# EAGLE design JLink-OB-F072 (EAGLE 7.7.0)
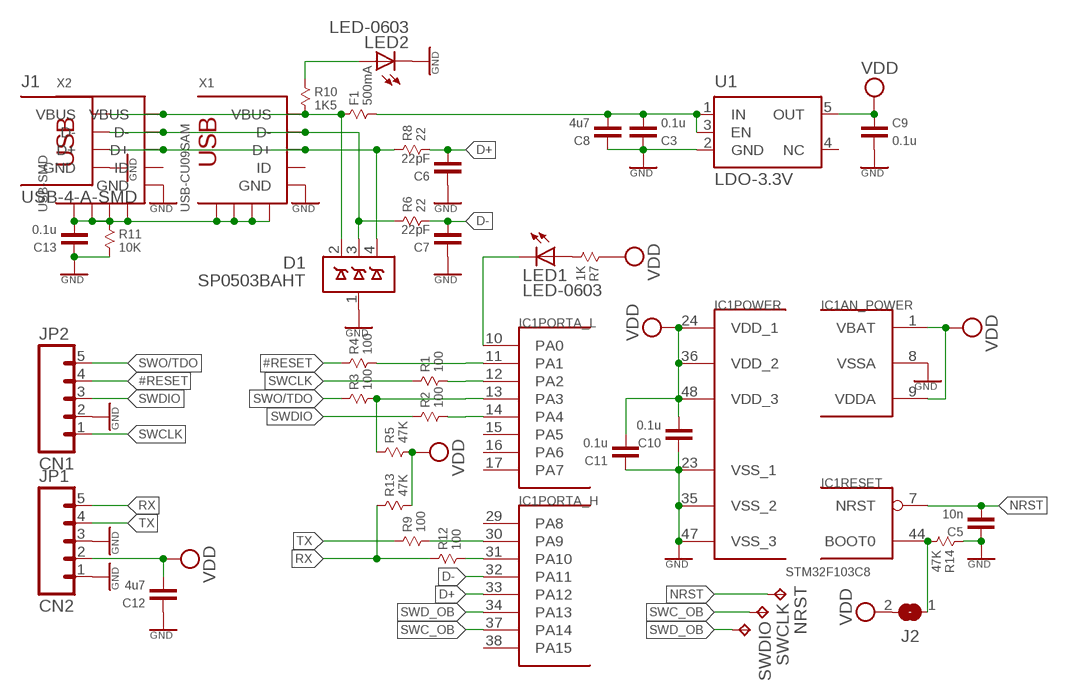
[diagram p0: schematic, sheet 1]

## Parts
C3  0.1u  CAP-0603  [0603]
C5  10n  CAP-0603  [0603]
C6  22pF  CAP-0603  [0603]
C7  22pF  CAP-0603  [0603]
C8  4u7  CAP-0603  [0603]
C9  0.1u  CAP-0603  [0603]
C10  0.1u  CAP-0603  [0603]
C11  0.1u  CAP-0603  [0603]
C12  4u7  CAP-0603  [0603]
C13  0.1u  CAP-0603  [0603]
D1  SP0503BAHT  [SOT143]
F1  500mA  RESISTOR-0805  [0805]
IC1  STM32F103C8  STM32F10XCXT6  [TQFP48]
J1  USB-4-A-SMD  [USB-A-SMD]
J2  JUMPER2-0402-NC  [JUMPER2-0402_NC]
JP1  CN2  M05PTH  [1X05]
JP2  CN1  M05PTH  [1X05]
LED1  LED-0603  LEDCHIPLED_0603  [CHIPLED_0603]
LED2  LED-0603  LEDCHIPLED_0603  [CHIPLED_0603]
NRST  TPTP10R  [TP10R]
R1  100  RESISTOR-0603  [0603]
R2  100  RESISTOR-0603  [0603]
R3  100  RESISTOR-0603  [0603]
R4  100  RESISTOR-0603  [0603]
R5  47K  RESISTOR-0603  [0603]
R6  22  RESISTOR-0603  [0603]
R7  1K  RESISTOR-0603  [0603]
R8  22  RESISTOR-0603  [0603]
R9  100  RESISTOR-0603  [0603]
R10  1K5  RESISTOR-0603  [0603]
R11  10K  RESISTOR-0603  [0603]
R12  100  RESISTOR-0603  [0603]
R13  47K  RESISTOR-0603  [0603]
R14  47K  RESISTOR-0603  [0603]
SWCLK  TPTP10R  [TP10R]
SWDIO  TPTP10R  [TP10R]
U1  LDO-3.3V  TPS73033-DC  [SOT23-5]
X1  USB-CU09SAM  [CU09SAM]
X2  USB-SMD  [USB-MINIB]

## Nets
#RESET: JP2.4 R4.1
#RESETR: IC1.11(PORTA_L:PA1) R4.2
D+: C6.1 IC1.33(PORTA_H:PA12) R8.2
D-: C7.1 IC1.32(PORTA_H:PA11) R6.2
GND: C3.2 C5.2 C6.2 C7.2 C8.2 C9.1 C10.2 C11.2 C12.2 C13.2 D1.1(GND) IC1.8(AN_POWER:VSSA) IC1.23(POWER:VSS_1) IC1.35(POWER:VSS_2) IC1.47(POWER:VSS_3) J1.GND JP1.1 JP1.3 JP2.2 LED2.C R11.2 R14.1 U1.2(GND) X1.5(GND) X2.GND
N$1: LED1.A R7.2
N$2: D1.4(D3) J1.D+ R8.1 X1.3(D+) X2.D+
N$3: IC1.10(PORTA_L:PA0) LED1.C
N$4: D1.3(D2) J1.D- R6.1 X1.2(D-) X2.D-
N$5: IC1.30(PORTA_H:PA9) R9.2
N$6: IC1.31(PORTA_H:PA10) R12.2
N$7: LED2.A R10.1
N$8: C3.1 C8.1 F1.2 U1.1(IN) U1.3(EN)
N$9: IC1.44(RESET:BOOT0) J2.1 R14.2
N$10: C13.1 R11.1 X1.GND@1(GND) X1.GND@2(GND) X1.GND@3(GND) X1.GND@4(GND) X2.GND@1(GND) X2.GND@2(GND) X2.GND@3(GND) X2.GND@4(GND)
NRST: C5.1 IC1.7(RESET:NRST) NRST.TP
RX: JP1.5 R12.1 R13.1
SWC_OB: IC1.37(PORTA_H:PA14) SWCLK.TP
SWCLK: JP2.1 R1.1
SWCLKR: IC1.12(PORTA_L:PA2) R1.2
SWD_OB: IC1.34(PORTA_H:PA13) SWDIO.TP
SWDIO: JP2.3 R2.1
SWDIOR: IC1.14(PORTA_L:PA4) R2.2
SWO/TDO: JP2.5 R3.1
SWOR: IC1.13(PORTA_L:PA3) R3.2 R5.1
TX: JP1.4 R9.1
VBUS: D1.2(D1) F1.1 J1.VUSB(VBUS) R10.2 X1.1(VBUS) X2.VBUS
VDD: C9.2 C10.1 C11.1 C12.1 IC1.1(AN_POWER:VBAT) IC1.9(AN_POWER:VDDA) IC1.24(POWER:VDD_1) IC1.36(POWER:VDD_2) IC1.48(POWER:VDD_3) J2.2 JP1.2 R5.2 R7.1 R13.2 U1.5(OUT)
Unconnected: IC1.2(PORTC:PC13) IC1.3(PORTC:PC14) IC1.4(PORTC:PC15) IC1.5(PORTD/OSC:PD0/OSC<=) IC1.6(PORTD/OSC:PD1/OSC=>) IC1.15(PORTA_L:PA5) IC1.16(PORTA_L:PA6) IC1.17(PORTA_L:PA7) IC1.18(PORTB_L:PB0) IC1.19(PORTB_L:PB1) IC1.20(PORTB_L:PB2) IC1.21(PORTB_H:PB10) IC1.22(PORTB_H:PB11) IC1.25(PORTB_H:PB12) IC1.26(PORTB_H:PB13) IC1.27(PORTB_H:PB14) IC1.28(PORTB_H:PB15) IC1.29(PORTA_H:PA8) IC1.38(PORTA_H:PA15) IC1.39(PORTB_L:PB3) IC1.40(PORTB_L:PB4) IC1.41(PORTB_L:PB5) IC1.42(PORTB_L:PB6) IC1.43(PORTB_L:PB7) IC1.45(PORTB_H:PB8) IC1.46(PORTB_H:PB9) U1.4(NC) X1.4(ID) X2.ID

## Library data of the parts
C3 C5-C13 = X893:CAP: Capacitor
D1 = X893:SP0503BAHT: Surface Mount TVS Avalanche Diode Array (5V) http://www.littelfuse.com/data/en/Data_Sheets/SP05xxBA.pdf
F1 R1-R14 = X893:RESISTOR
IC1 = stm32:STM32F10XCXT6: ST STM32F101/103 48pin LQFP
J1 = X893:USB-4: http://www.hirose.co.jp/cataloge_hp/e24200011.pdf
J2 = we-rcl:JUMPER2: 2 Pin Jumpers
JP1 JP2 = SparkFun:M05: Header 5 Standard 5-pin 0.1" header. Use with straight break away headers (SKU : PRT-00116), right angle break away headers (PRT-00553), swiss pins (PRT-00743), machine pins (PRT-00117), and female headers (PRT-00115). Molex polarized connector foot print use with SKU : PRT-08230 with associated crimp pins and housings.
LED1 LED2 = led:LED: LED OSRAM: - CHIPLED LG R971, LG N971, LY N971, LG Q971, LY Q971, LO R971, LY R971 LH N974, LH R974 LS Q976, LO Q976, LY Q976 LO Q996 - Hyper CHIPLED LW Q18S LB Q993, LB Q99A, LB R99A - SideLED LS A670, LO A670, LY A670, LG A670, LP A670 LB A673, LV A673, LT A673, LW A673 LH A674 LY A675 LS A676, LA A676, LO A676, LY A676, LW A676 LS A679, LY A679, LG A679 - Hyper Micro SIDELED® LS Y876, LA Y876, LO Y876, LY Y876 LT Y87S - SmartLED LW L88C, LW L88S LB L89C, LB L89S, LG L890 LS L89K, LO L89K, LY L89K LS L896, LA L896, LO L896, LY L896 - TOPLED LS T670, LO T670, LY T670, LG T670, LP T670 LSG T670, LSP T670, LSY T670, LOP T670, LYG T670 LG T671, LOG T671, LSG T671 LB T673, LV T673, LT T673, LW T673 LH T674 LS T676, LA T676, LO T676, LY T676, LB T676, LH T676, LSB T676, LW T676 LB T67C, LV T67C, LT T67C, LS T67K, LO T67K, LY T67K, LW E67C LS E67B, LA E67B, LO E67B, LY E67B, LB E67C, LV E67C, LT E67C LW T67C LS T679, LY T679, LG T679 LS T770, LO T770, LY T770, LG T770, LP T770 LB T773, LV T773, LT T773, LW T773 LH T774 LS E675, LA E675, LY E675, LS T675 LS T776, LA T776, LO T776, LY T776, LB T776 LHGB T686 LT T68C, LB T68C - Hyper Mini TOPLED® LB M676 - Mini TOPLED Santana® LG M470 LS M47K, LO M47K, LY M47K Source: http://www.osram.convergy.de LUXEON: - LUMILED® LXK2-PW12-R00, LXK2-PW12-S00, LXK2-PW14-U00, LXK2-PW14-V00 LXK2-PM12-R00, LXK2-PM12-S00, LXK2-PM14-U00 LXK2-PE12-Q00, LXK2-PE12-R00, LXK2-PE12-S00, LXK2-PE14-T00, LXK2-PE14-U00 LXK2-PB12-K00, LXK2-PB12-L00, LXK2-PB12-M00, LXK2-PB14-N00, LXK2-PB14-P00, LXK2-PB14-Q00 LXK2-PR12-L00, LXK2-PR12-M00, LXK2-PR14-Q00, LXK2-PR14-R00 LXK2-PD12-Q00, LXK2-PD12-R00, LXK2-PD12-S00 LXK2-PH12-R00, LXK2-PH12-S00 LXK2-PL12-P00, LXK2-PL12-Q00, LXK2-PL12-R00 Source: www.luxeon.com KINGBRIGHT: KA-3528ASYC Source: www.kingbright.com
NRST SWCLK SWDIO = testpad:TP: Test pad
U1 = X893:TPS73033: LOW-NOISE, HIGH PSRR, RF 200-mA LOW-DROPOUT LINEAR REGULATOR http://www.terraelectronica.ru/pdf/TI/TPS73033.pdf
X1 X2 = X893:USB: USB Connectors USB-B-PTH is fully proven SKU : PRT-00139 USB-miniB is fully proven SKU : PRT-00587 USB-A-PCB is untested. USB-A-H is throughly reviewed, but untested. Spark Fun Electronics SKU : PRT-00437 USB-B-SMT is throughly reviewed, but untested. Needs silkscreen touching up. USB-A-S has not been used/tested USB-MB-H has not been used/tested

## Board
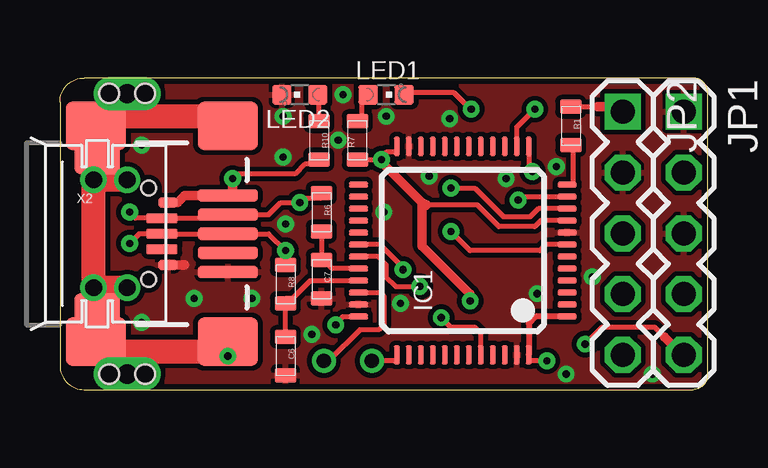
[diagram p1: board, top side]
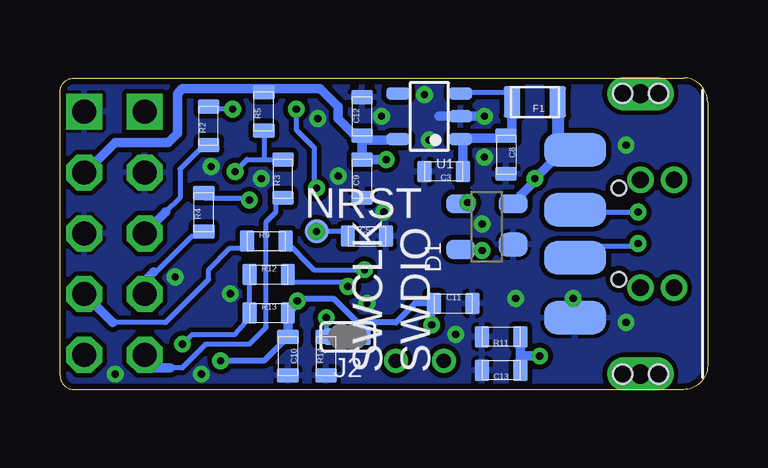
[diagram p2: board, bottom side, seen from below]

Size 27 x 13 mm. Coordinates in mm from the lower left corner, seen from the top.
Outline: 27,0.6 27,12.4 arc90 26.4,13 1,13 arc90 0,12 0,1 arc90 1,0 26.4,0 arc90 27,0.6
Copper layers (1+16): Top 0.018mm / dielectric 0.8mm / Bottom 0.018mm
Design rules "Rezonit-020-015": minimum track width 0.15mm, minimum drill 0.3mm, track to track 0.2mm, track to pad 0.2mm, pad to pad 0.2mm, via to via 0.2mm, smd to smd 0mil, copper to edge 0.25mm, drill to drill 0.3mm, minimum pad ring 0.2mm, minimum via ring 0.2mm, stop-mask expansion 4mil, vias tented up to drill 0.4mm, thermal gap 0.15mm

### Footprints (pad centres in the part's own frame; a part is rotated, then mirrored left to right if it is on the bottom)
0603 = smd 0.6 x 0.9: 1 -0.8,0; 2 0.8,0
SOT143 = smd 1 x 1.2: 1 -0.75,-1.1 | smd 0.8 x 1.2: 2 0.95,-1.1; 3 0.95,1.1; 4 -0.95,1.1
0805 = smd 0.7 x 1.3: 1 -0.95,0; 2 0.95,0
TQFP48 = smd 0.25 x 0.8: 1 -2.75,-4.35; 2 -2.25,-4.35; 3 -1.75,-4.35; 4 -1.25,-4.35; 5 -0.75,-4.35; 6 -0.25,-4.35; 7 0.25,-4.35; 8 0.75,-4.35; 9 1.25,-4.35; 10 1.75,-4.35; 11 2.25,-4.35; 12 2.75,-4.35; 25 2.75,4.35; 26 2.25,4.35; 27 1.75,4.35; 28 1.25,4.35; 29 0.75,4.35; 30 0.25,4.35; 31 -0.25,4.35; 32 -0.75,4.35; 33 -1.25,4.35; 34 -1.75,4.35; 35 -2.25,4.35; 36 -2.75,4.35 | smd 0.8 x 0.25: 13 4.35,-2.75; 14 4.35,-2.25; 15 4.35,-1.75; 16 4.35,-1.25; 17 4.35,-0.75; 18 4.35,-0.25; 19 4.35,0.25; 20 4.35,0.75; 21 4.35,1.25; 22 4.35,1.75; 23 4.35,2.25; 24 4.35,2.75; 37 -4.35,2.75; 38 -4.35,2.25; 39 -4.35,1.75; 40 -4.35,1.25; 41 -4.35,0.75; 42 -4.35,0.25; 43 -4.35,-0.25; 44 -4.35,-0.75; 45 -4.35,-1.25; 46 -4.35,-1.75; 47 -4.35,-2.25; 48 -4.35,-2.75
USB-A-SMD = smd 2.6 x 1.4: D+ 5.325,1; D- 5.325,-1; GND 5.325,3.5; VUSB 5.325,-3.5 | drill 0.8 pad 1.4 long: GND@1 2.6,5.85; GND@2 2.6,-5.85 | drill 0.7: P$1 2.6,2.25; P$2 2.6,-2.25; P$3 1.2,2.25; P$4 1.2,-2.25 | hole 0.8: 3.35,-5.85; 1.85,-5.85; 3.35,5.85; 1.85,5.85
JUMPER2-0402_NC = smd 0.7 x 0.8: 1 0,0.55; 2 0,-0.55
1X05 = drill 1 pad 1.5 square: 1 0,0 | drill 1 pad 1.5 octagon: 2 2.54,0; 3 5.08,0; 4 7.62,0; 5 10.16,0
CHIPLED_0603 = smd 0.8 x 0.8: A 0,-0.75; C 0,0.75
TP10R = smd 1 x 1: TP 0,0
SOT23-5 = smd 0.5 x 1: 1 -0.95,-1.3; 2 0,-1.3; 3 0.95,-1.3; 4 0.95,1.3; 5 -0.95,1.3
CU09SAM = smd 0.4 x 0.8: 1 1.3,-5.1; 5 -1.3,-5.1 | smd 0.4 x 1.3: 2 0.65,-4.85; 3 0,-4.85; 4 -0.65,-4.85 | smd 1.8 x 1.9: GND@1 -3.4,-2.15; GND@4 3.4,-2.15 | smd 1 x 1: GND@2 -3.2,-2.2; GND@3 3.2,-2.2 | hole 0.6: -1.9,-4.3; 1.9,-4.3
USB-MINIB = smd 2.5 x 0.5: D+ 2.5,0; D- 2.5,0.8; GND 2.5,-1.6; ID 2.5,-0.8; VBUS 2.5,1.6 | smd 2.5 x 2: GND@1 -3,-4.5; GND@2 -3,4.5; GND@3 2.5,4.5; GND@4 2.5,-4.5

### Placement (x,y rotation side)
C3  11,9.1 180 bottom
C5  14.2,6.4 0 bottom
C6  9.4,1.4 270 top
C7  10.9,4.6 270 top
C8  8.4,9.8 270 bottom
C9  14.4,8.8 90 bottom
C10  17.5,1.4 270 bottom
C11  10.6,3.6 0 bottom
C12  14.4,11.4 90 bottom
C13  8.6,0.8 180 bottom
D1  9.2,6.8 90 bottom
F1  7.2,12 180 bottom
IC1  16.8,5.8 90 top
J1  0.2,6.5 180 bottom
J2  15,2.2 90 bottom
JP1  26,11.6 270 top
JP2  23.46,11.6 270 top
LED1  13.6,12.3 270 top
LED2  10,12.3 90 top
NRST  16.3,6.6 0 bottom
R1  21.3,11 270 top
R2  20.8,11 90 bottom
R3  17.7,8.8 90 bottom
R4  21,7.4 90 bottom
R5  18.5,11.6 90 bottom
R6  10.9,7.4 270 top
R7  12.4,10.4 90 top
R8  9.4,4.4 270 top
R9  18.4,6.2 0 bottom
R10  10.8,10.4 270 top
R11  8.6,2.2 180 bottom
R12  18.3,4.8 0 bottom
R13  18.3,3.2 0 bottom
R14  15.9,1.4 90 bottom
SWCLK  13,1.2 90 bottom
SWDIO  11,1.2 90 bottom
U1  11.6,11.4 90 bottom
X1  -0.6,6.5 90 top
X2  4.5,6.5 0 top

### Tracks (layer width: path | path; a pad name or v marks a point on that pad's centre or on a via)
#RESET
  Bottom 0.2: JP2.4 23.42,3.98 23.6,4.4 | 23.1,4.9 23,4.9 21.5,6.4 21,6.4 R4.1
  Bottom 0.4: 23.6,4.4 23.1,4.9
#RESETR  (via drill 0.3)
  Top 0.2: IC1.11 19.25,8.05 v19.1,7.9
  Bottom 0.2: R4.2 21,8 19.2,8 v19.1,7.9
D+
  Top 0.2: C6.1 R8.2 9.4,3.8 9.7,3.8 10.45,4.55 IC1.33
D-
  Top 0.2: R6.2 C7.1 11.2,5.2 11.35,5.05 IC1.32
GND  (via drill 0.3)
  Top 0.4: 4.4,5.2 5.2,5.2
  Bottom 0.4: v9.3,11.4 11.2,11.4
  other vias: 8,3.8 3.4,2.8 9.4,6.9 3.4,10.2 5.6,3.8 10.5,2.3 21.1,0.65 9.3,9.7 13.6,11.4 11.6,10.4 14.2,3.6 15.4,8.9 11.8,12.3 16.25,11.3 13.5,7.4 18.6,8.8 20.7,9.3 24.7,0.65 22.2,4.7 19.9,4
  pour Top (isolate 0.2): 26.8,0.2 26.8,12.8 0.2,12.8 0.2,0.2
  pour Bottom (isolate 0.2): 26.8,0.2 26.8,12.8 0.2,12.8 0.2,0.2
N$1
  Top 0.2: R7.2 12.6,11.2 12.6,12.3 LED1.A
N$2  (via drill 0.3)
  Top 0.2: R8.1 v9.4,5.8 8.7,6.5 X2.D+ X1.3 3.3,6.5 v2.9,6.1
  Bottom 0.2: D1.4 10.2,5.8 v9.4,5.8 9.4,5.7 | J1.D+ 5.53,5.78 5.3,6 3,6 v2.9,6.1
N$3  (via drill 0.3)
  Top 0.2: v16.3,8.4 17.3,8.4 18.5,7.2 19.6,7.2 19.95,7.55 IC1.10 | LED1.C 14.35,12.4 16.4,12.4 17.15,11.65 v17.15,11.7
  Bottom 0.2: v17.15,11.7 17.15,10.85 16.4,10.1 16.4,8.5 v16.3,8.4
N$4  (via drill 0.3)
  Top 0.2: R6.1 10.9,8 10,8 v10,7.8 9.2,7.8 8.7,7.3 X2.D- 6.9,7.15 X1.2 3.15,7.15 v2.9,7.4
  Bottom 0.2: D1.3 10,7.75 v10,7.8 | J1.D- 5.42,7.4 v2.9,7.4
N$5  (via drill 0.3)
  Top 0.2: IC1.30 13.35,6.05 14.3,5.1 v14.3,5
  Bottom 0.2: R9.2 16.4,5 v14.3,5
N$6  (via drill 0.3)
  Top 0.2: IC1.31 13.25,5.55 13.6,5.2 13.6,4.7 14,4.3 v15,4.3
  Bottom 0.2: R12.2 17.6,4.5 15.2,4.5 v15,4.3
N$7
  Top 0.2: R10.1 10.8,12.3 LED2.A
N$8
  Bottom 0.2: U1.3 10.05,12.35 10,12.4 8.15,12.4 F1.2
  Bottom 0.4: F1.2 8.15,10.6 C8.1 8.4,10.5 10.25,10.5 U1.1 10.2,10.35 C3.1
N$9  (via drill 0.3)
  Top 0.2: IC1.44 17.55,2.35 17.3,2.6 16.3,2.6 v15.9,3
  Bottom 0.2: v15.9,3 R14.2 J2.1
N$10  (via drill 0.3)
  Top 0.2: v7,1.4 7,1.6
  Top 0.9: 2.8,8.7 1.4,8.7 | 2.8,4.3 1.4,4.3
  Top 1: 1.4,3.1 X2.GND@1 1.4,1.6 6.8,1.6 | 1.4,3.1 1.4,4.3 1.4,8.7 1.4,9.9 | 1.4,9.9 X2.GND@2 1.4,11.4 6.8,11.4 6.8,11 X2.GND@3 | X1.GND@3 1.55,9.7 X1.GND@4 1.4,9.9 | X1.GND@2 1.55,3.3 X1.GND@1 1.4,3.1 | 7,1.6 6.8,1.6 | 6.8,1.6 6.8,2 X2.GND@4
  Bottom 0.4: R11.1 7.8,1.4 | 7.8,1.4 v7,1.4 | C13.1 7.8,1.4
NRST  (via drill 0.3)
  Top 0.2: NRST.TP 17.1,5.8 20,5.8 20.25,6.05 IC1.7
  Bottom 0.2: C5.1 15.2,6.6 NRST.TP
  other vias: 16.3,6.6
RX  (via drill 0.3)
  Top 0.2: JP1.5 25.96,1.44 25.8,1.6 | 25.2,2.2 24.8,2.6 22.6,2.6 v21.9,1.9
  Top 0.4: 25.8,1.6 25.2,2.2
  Bottom 0.2: R12.1 R13.1 19.1,3 19.7,2.3 21.5,2.3 v21.9,1.9
SWC_OB  (via drill 0.6)
  Top 0.2: IC1.37 14.05,1.2 SWCLK.TP
  other vias: 13,1.2
SWCLK
  Top 0.2: R1.1 22.4,11.8 | 23.4,11.8 23.46,11.8 JP2.1
  Top 0.4: 22.4,11.8 23.4,11.8
SWCLKR
  Top 0.2: IC1.12 21.2,8.55 21.4,8.6 21.4,10.2 R1.2
SWD_OB  (via drill 0.6)
  Top 0.2: IC1.34 13.35,4.05 13.5,3.9 13.5,2.7 13.3,2.5 12.5,2.5 11.2,1.2 SWDIO.TP
  other vias: 11,1.2
SWDIO
  Bottom 0.2: R2.1 21,10.2 22,9.2 22,8 22.6,7.4 | 23.4,6.6 23.4,6.58 JP2.3
  Bottom 0.4: 22.6,7.4 23.4,6.6
SWDIOR  (via drill 0.3)
  Top 0.2: IC1.14 19.05,10.95 v19.8,11.7
  Bottom 0.2: v19.8,11.7 20.8,11.7 R2.2
SWO/TDO
  Bottom 0.2: JP2.5 23.42,0.9 | R3.1 18,8 18,7.4 18.4,7 18.4,2.6 19.1,1.9 20.9,1.9 21.9,0.9 22.4,0.9
  Bottom 0.4: 23.42,0.9 22.4,0.9
SWOR  (via drill 0.3)
  Top 0.2: IC1.13 19.55,9.3 v19.7,9.1
  Bottom 0.2: v19.7,9.1 19.2,9.6 R3.2 18.5,9.6 R5.1
TX
  Bottom 0.2: 19.4,6 R9.1 19.4,5.9 19.9,5.9 20.8,5 20.8,4.6 22.6,2.8 24.8,2.8 | 25.8,3.8 25.98,4 JP1.4
  Bottom 0.4: 24.8,2.8 25.8,3.8
VBUS  (via drill 0.3)
  Top 0.2: R10.2 10.8,9.4 10.2,9.4 9.8,9 7.4,9 v7.2,8.8
  Top 0.4: X1.1 4.9,7.8 5.2,8.1 X2.VBUS 7.2,8.1 v7.2,8.8
  Bottom 0.4: J1.VUSB 6,10 v7.2,8.8 7.2,8.7 7.8,8.1 7.8,7.85 D1.2
  Bottom 0.5: F1.1 6.25,10.12 J1.VUSB
VDD  (via drill 0.3)
  Top 0.2: v20.3,1.2 19.55,1.2 IC1.48 | v11.5,2.7 11.8,3.05 IC1.36 | IC1.24 14.05,9.9 13.6,9.9 v13.4,9.6 R7.1 | 15.4,7.7 17.4,7.7 18.3,6.8 19.8,6.8 20.05,7.05 IC1.9 | 15.4,7.7 15.3,7.8 15.1,7.8 | 15.4,7.7 15.1,7.4
  Top 0.25: IC1.1 19.85,3.05 19.55,2.75 IC1.48
  Top 0.4: v17.1,3.7 17.1,4 15.1,6 15.1,7.4 15.1,7.8 13.4,9.5 v13.4,9.6
  Bottom 0.2: 14.6,2.8 14.6,2.25 J2.2
  Bottom 0.25: 11.5,3.6 12.2,3.6 13,2.8 14.6,2.8 15.6,3.8 17.1,3.8 v17.1,3.7 | C11.1 11.5,3.6 | 11.5,3.6 v11.5,2.7 | C10.1 18.5,1.2 v20.3,1.2
  Bottom 0.4: JP1.2 25.94,9.06 24.7,10.3 22.5,10.3 22.1,10.7 22.1,12.35 21.9,12.55 18.5,12.55 | 14.4,10.4 C9.2 v13.4,9.6 | U1.5 12.9,10.4 14.4,10.4 | R5.2 18.5,12.55 | 18.5,12.55 16.15,12.55 15.4,11.8 15.4,11.3 14.8,10.7 14.4,10.7 C12.1 14.4,10.4 | v17.1,3.7 R13.2 C10.1

### Text on the board
Reference: PWR | ACT | SWCLK | GND | GND | +3.3 | SWDIO | GND | RESET | TX | SWO | RX | SWD_OB | SWC_OB